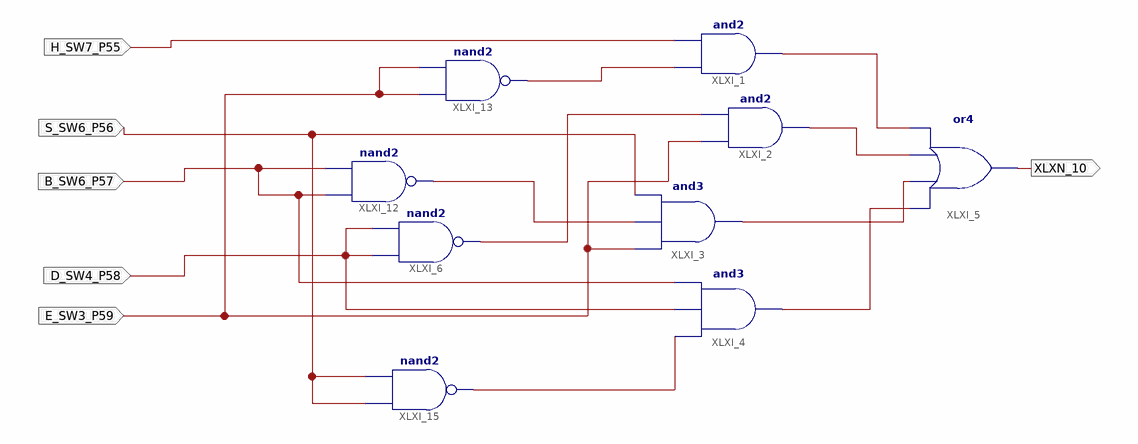
[diagram p0: schematic sheet 1]
// Xilinx ISE schematic Lab_04.sch (spartan6) as structural Verilog: 9 symbols, 6 ports
module Lab_04 (
  input  H_SW7_P55,
  input  S_SW6_P56,
  input  B_SW6_P57,
  input  D_SW4_P58,
  input  E_SW3_P59,
  output XLXN_10
);

  wire XLXN_1, XLXN_2, XLXN_8, XLXN_9, XLXN_26, XLXN_32, XLXN_35, XLXN_49;

  nand XLXI_6 (XLXN_26, D_SW4_P58, D_SW4_P58);
  and XLXI_1 (XLXN_1, XLXN_35, H_SW7_P55);
  and XLXI_2 (XLXN_2, E_SW3_P59, XLXN_26);
  and XLXI_4 (XLXN_9, XLXN_49, D_SW4_P58, B_SW6_P57);
  or XLXI_5 (XLXN_10, XLXN_9, XLXN_8, XLXN_2, XLXN_1);
  and XLXI_3 (XLXN_8, E_SW3_P59, XLXN_32, S_SW6_P56);
  nand XLXI_12 (XLXN_32, B_SW6_P57, B_SW6_P57);
  nand XLXI_13 (XLXN_35, E_SW3_P59, E_SW3_P59);
  nand XLXI_15 (XLXN_49, S_SW6_P56, S_SW6_P56);
endmodule
